# Altium project Core.PrjPcb
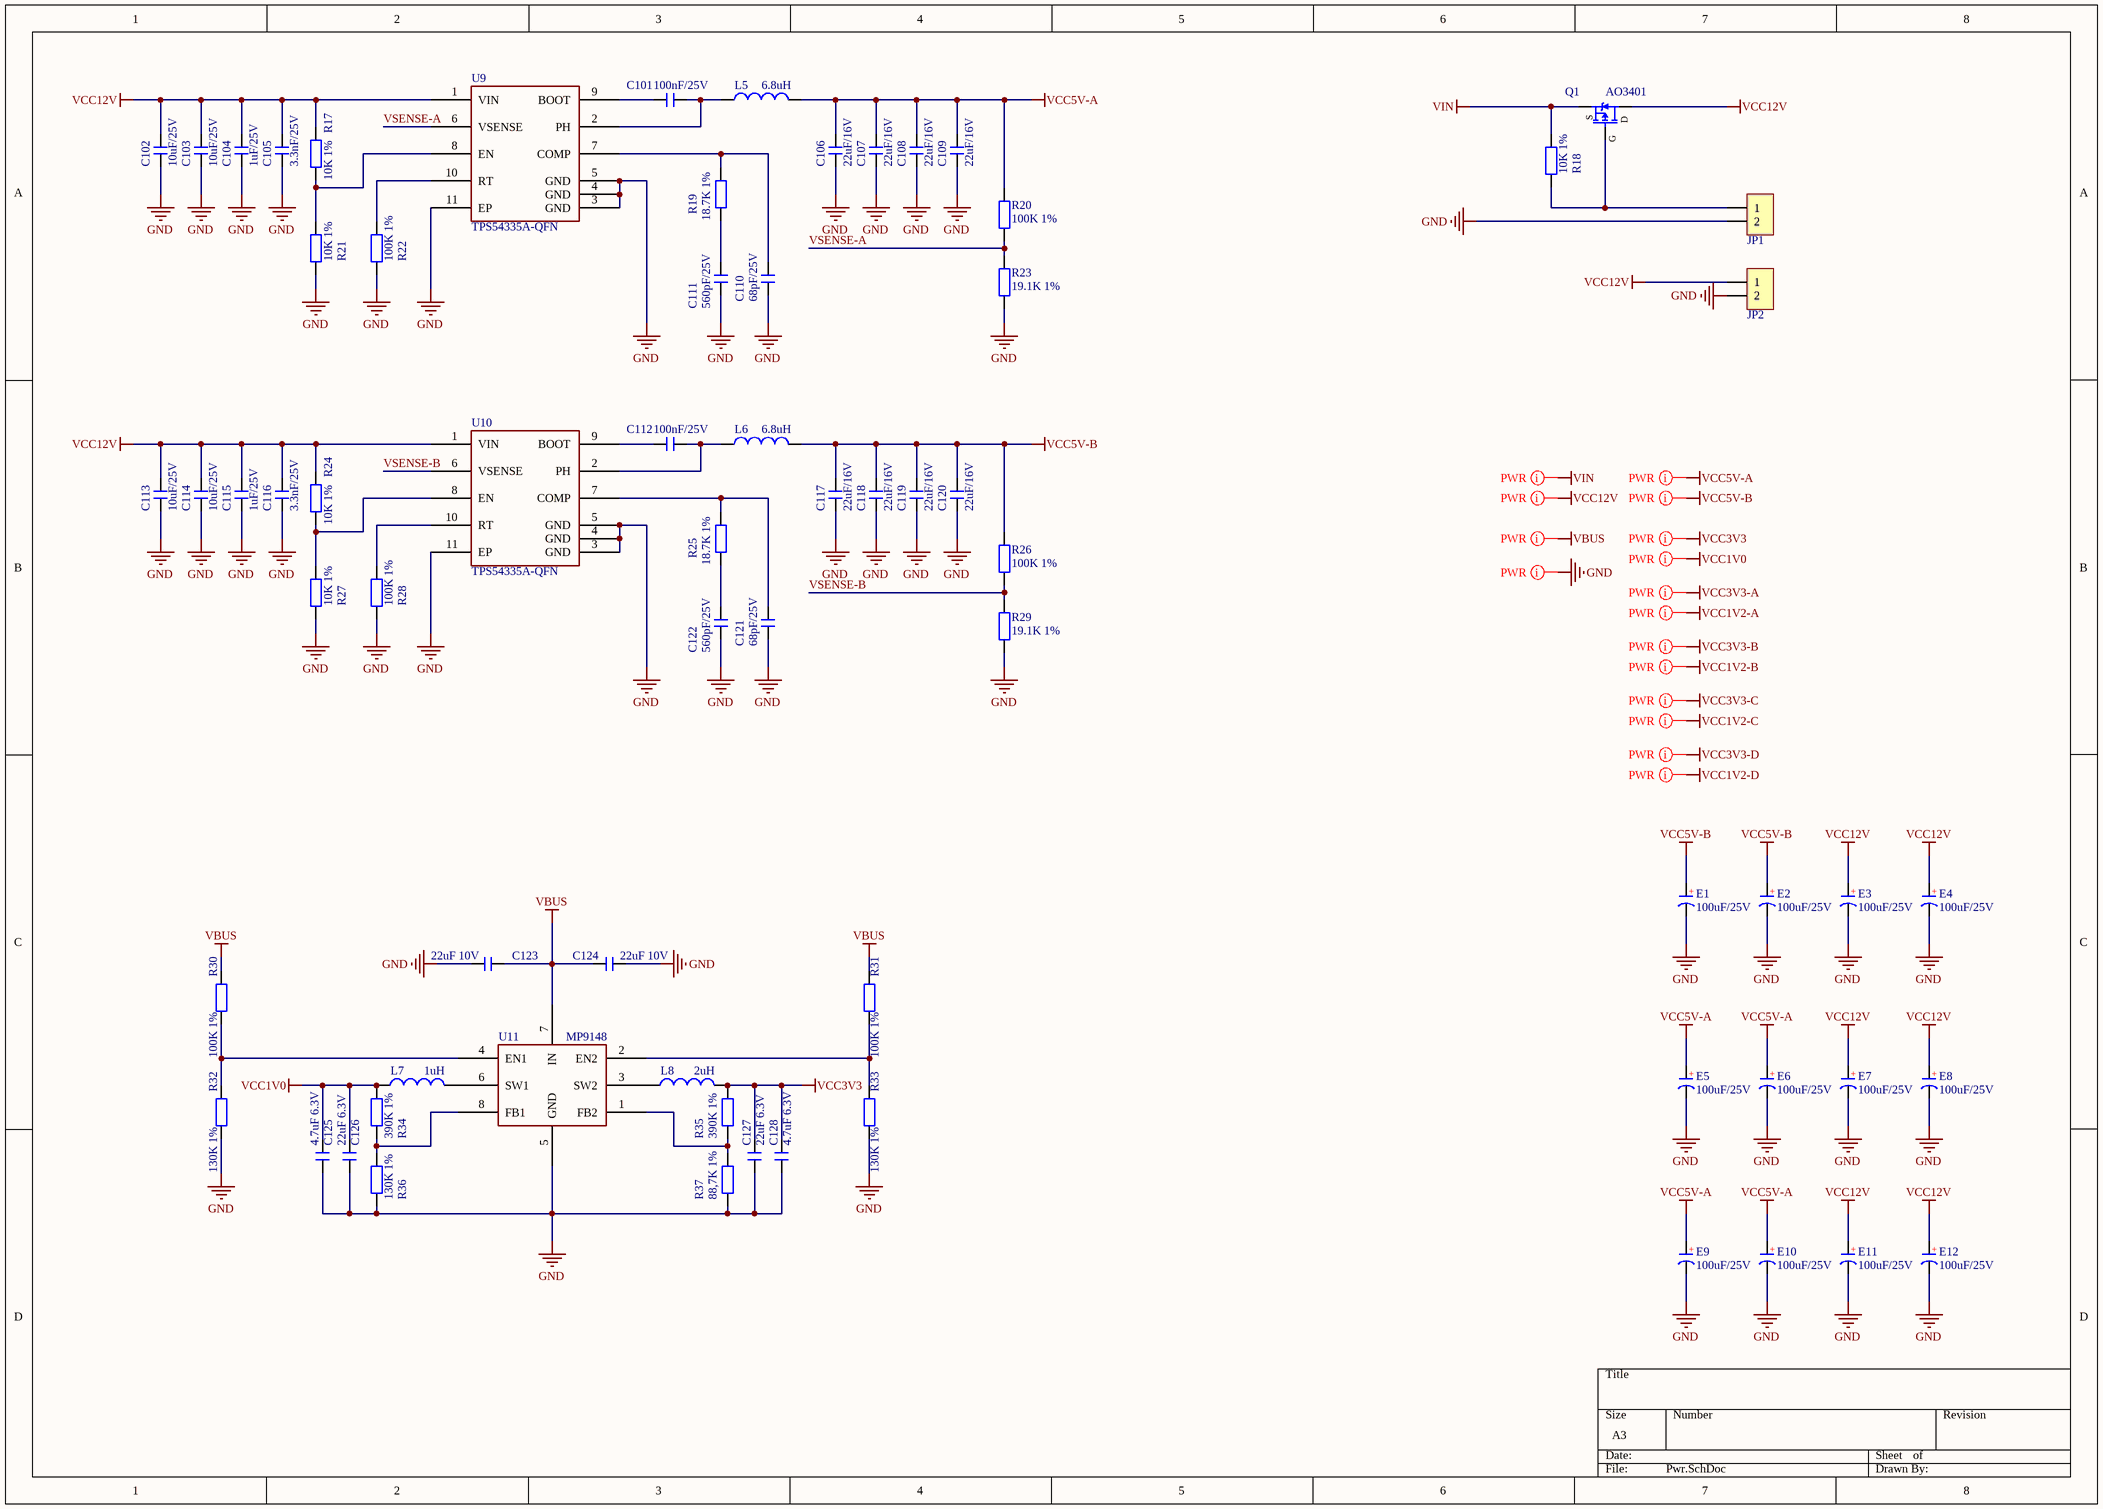
[diagram p0: Pwr.SchDoc]
2 sheets, 125 parts. Net scope: global (net labels, ports and power ports of the same name join across sheets).
Board files: PCB1.PcbDoc, Core.PcbDoc
Sheets:
  Pwr.SchDoc
  Vl822.SchDoc

## Sheet Pwr.SchDoc
size A3; SheetNumber: 3; SheetTotal: 4

### Parts
C101  100nF/25V  [C0402_L]
C102  10uF/25V  [C0603_L]
C103  10uF/25V  [C0603_L]
C104  1uF/25V  [C0603_L]
C105  3.3nF/25V  [C0603_L]
C106  22uF/16V  [C0603_L]
C107  22uF/16V  [C0603_L]
C108  22uF/16V  [C0603_L]
C109  22uF/16V  [C0603_L]
C110  68pF/25V  [C0402_L]
C111  560pF/25V  [C0402_L]
C112  100nF/25V  [C0402_L]
C113  10uF/25V  [C0603_L]
C114  10uF/25V  [C0603_L]
C115  1uF/25V  [C0603_L]
C116  3.3nF/25V  [C0603_L]
C117  22uF/16V  [C0603_L]
C118  22uF/16V  [C0603_L]
C119  22uF/16V  [C0603_L]
C120  22uF/16V  [C0603_L]
C121  68pF/25V  [C0402_L]
C122  560pF/25V  [C0402_L]
C123  22uF 10V  [C0603_L]
C124  22uF 10V  [C0603_L]
C125  4.7uF 6.3V  [C0603_L]
C126  22uF 6.3V  [C0603_L]
C127  22uF 6.3V  [C0603_L]
C128  4.7uF 6.3V  [C0603_L]
E1  100uF/25V  [CS 6*4 - B]
E2  100uF/25V  [CS 6*4 - B]
E3  100uF/25V  [CS 6*4 - B]
E4  100uF/25V  [CS 6*4 - B]
E5  100uF/25V  [CS 6*4 - B]
E6  100uF/25V  [CS 6*4 - B]
E7  100uF/25V  [CS 6*4 - B]
E8  100uF/25V  [CS 6*4 - B]
E9  100uF/25V  [CS 6*4 - B]
E10  100uF/25V  [CS 6*4 - B]
E11  100uF/25V  [CS 6*4 - B]
E12  100uF/25V  [CS 6*4 - B]
JP1  HDR-1X2  [ZH1.5-WS-2P]  (value not drawn)
JP2  HDR-1X2  [XH2.54-WS-2P]  (value not drawn)
L5  6.8uH  [NR4020]
L6  6.8uH  [NR4020]
L7  1uH  [NR4020]
L8  2uH  [NR4020]
Q1  AO3401  [DFN8-L3.0-W3.0-P0.65_EP]
R17  10K 1%  [R0402_L]
R18  10K 1%  [R0402_L]
R19  18.7K 1%  [R0402_L]
R20  100K 1%  [R0402_L]
R21  10K 1%  [R0402_L]
R22  100K 1%  [R0402_L]
R23  19.1K 1%  [R0402_L]
R24  10K 1%  [R0402_L]
R25  18.7K 1%  [R0402_L]
R26  100K 1%  [R0402_L]
R27  10K 1%  [R0402_L]
R28  100K 1%  [R0402_L]
R29  19.1K 1%  [R0402_L]
R30  100K 1%  [R0402_L]
R31  100K 1%  [R0402_L]
R32  130K 1%  [R0402_L]
R33  130K 1%  [R0402_L]
R34  390K 1%  [R0402_L]
R35  390K 1%  [R0402_L]
R36  130K 1%  [R0402_L]
R37  88,7K 1%  [R0402_L]
U9  TPS54335A-QFN  [VSON-10_L3.0-W3.0-P0.50-TL-EP]
U10  TPS54335A-QFN  [VSON-10_L3.0-W3.0-P0.50-TL-EP]
U11  MP9148  [SOT23-8]

### Nets
GND: C102.1 C103.1 C104.1 C105.1 C106.1 C107.1 C108.1 C109.1 C110.1 C111.1 C113.1 C114.1 C115.1 C116.1 C117.1 C118.1 C119.1 C120.1 C121.1 C122.1 C123.1 C124.1 C125.1 C126.1 C127.1 C128.1 E1.2(K) E2.2(K) E3.2(K) E4.2(K) E5.2(K) E6.2(K) E7.2(K) E8.2(K) E9.2(K) E10.2(K) E11.2(K) E12.2(K) JP1.2 JP2.2 R21.2 R22.2 R23.2 R27.2 R28.2 R29.2 R32.2 R33.2 R36.2 R37.2 U9.3(GND) U9.4(GND) U9.5(GND) U9.11(EP) U10.3(GND) U10.4(GND) U10.5(GND) U10.11(EP) U11.5(GND)
VBUS: C123.2 C124.2 R30.1 R31.1 U11.7(IN)
VCC1V0: C125.2 C126.2 L7.1 R34.1
VCC3V3: C127.2 C128.2 L8.1 R35.1
VCC5V-A: C106.2 C107.2 C108.2 C109.2 E5.1(A) E6.1(A) E9.1(A) E10.1(A) L5.2 R20.1
VCC5V-B: C117.2 C118.2 C119.2 C120.2 E1.1(A) E2.1(A) L6.2 R26.1
VCC12V: C102.2 C103.2 C104.2 C105.2 C113.2 C114.2 C115.2 C116.2 E3.1(A) E4.1(A) E7.1(A) E8.1(A) E11.1(A) E12.1(A) JP2.1 Q1.3(D) R17.1 R24.1 U9.1(VIN) U10.1(VIN)
VIN: Q1.2(S) R18.1
VSENSE-A: R20.2 R23.1 U9.6(VSENSE)
VSENSE-B: R26.2 R29.1 U10.6(VSENSE)
NetC101_1: C101.1 L5.1 U9.2(PH)
NetC101_2: C101.2 U9.9(BOOT)
NetC110_2: C110.2 R19.1 U9.7(COMP)
NetC111_2: C111.2 R19.2
NetC112_1: C112.1 L6.1 U10.2(PH)
NetC112_2: C112.2 U10.9(BOOT)
NetC121_2: C121.2 R25.1 U10.7(COMP)
NetC122_2: C122.2 R25.2
NetJP1_1: JP1.1 Q1.1(G) R18.2
NetL7_2: L7.2 U11.6(SW1)
NetL8_2: L8.2 U11.3(SW2)
NetR17_2: R17.2 R21.1 U9.8(EN)
NetR22_1: R22.1 U9.10(RT)
NetR24_2: R24.2 R27.1 U10.8(EN)
NetR28_1: R28.1 U10.10(RT)
NetR30_2: R30.2 R32.1 U11.4(EN1)
NetR31_2: R31.2 R33.1 U11.2(EN2)
NetR34_2: R34.2 R36.1 U11.8(FB1)
NetR35_2: R35.2 R37.1 U11.1(FB2)

### Layout directives
net class PWR; rule Width Constraint [Pref Width = 8mil    Min Width = 6mil    Max Width = 50mil]: GND, VBUS, VCC1V0, VCC1V2-A, VCC1V2-B, VCC1V2-C, VCC1V2-D, VCC3V3, VCC3V3-A, VCC3V3-B, VCC3V3-D, VCC5V-A, VCC5V-B, VCC12V, VIN
net class PWR: VCC3V3-C

### Notes on the sheet
- Labels drawn without touching a wire or pin: GND, VBUS, VCC1V0, VCC1V2-A, VCC1V2-B, VCC1V2-C, VCC1V2-D, VCC3V3, VCC3V3-A, VCC3V3-B, VCC3V3-C, VCC3V3-D, VCC5V-A, VCC5V-B, VCC12V, VIN
- (in symbol C-CD) +

### Library data of the parts
C101-C128 = C: 无极性贴片电容; 版权归属: 源创客; 材质: X7R; BOM名称: 无极性贴片电容; 学习资源: www.ooocke.com
E1-E12 = C-CD: 贴片钽电容; 版权归属: 源创客; BOM名称: 贴片钽电容; 学习资源: www.ooocke.com
JP1 JP2 = Header 2: 2P接插件; 版权归属: 源创客; BOM名称: 2P接插件; 学习资源: www.ooocke.com
L5-L8 = L: 小功率贴片电感; 版权归属: 源创客; BOM名称: 小功率贴片电感; 学习资源: www.ooocke.com
Q1 = AO3401: P沟道 30V/4.2A; BOM名称: 场效应管; 版权归属: 源创客; 学习资源: www.ooocke.com; 描述: P沟道 30V/4.2A
R17-R37 = R: 贴片电阻; 版权归属: 源创客; BOM名称: 贴片电阻; 学习资源: www.ooocke.com
U9 U10 = TPS54335A-QFN: BUCK
U11 = MP9148: BUCK

## Sheet Vl822.SchDoc
size A3; SheetNumber: 4; SheetTotal: 4
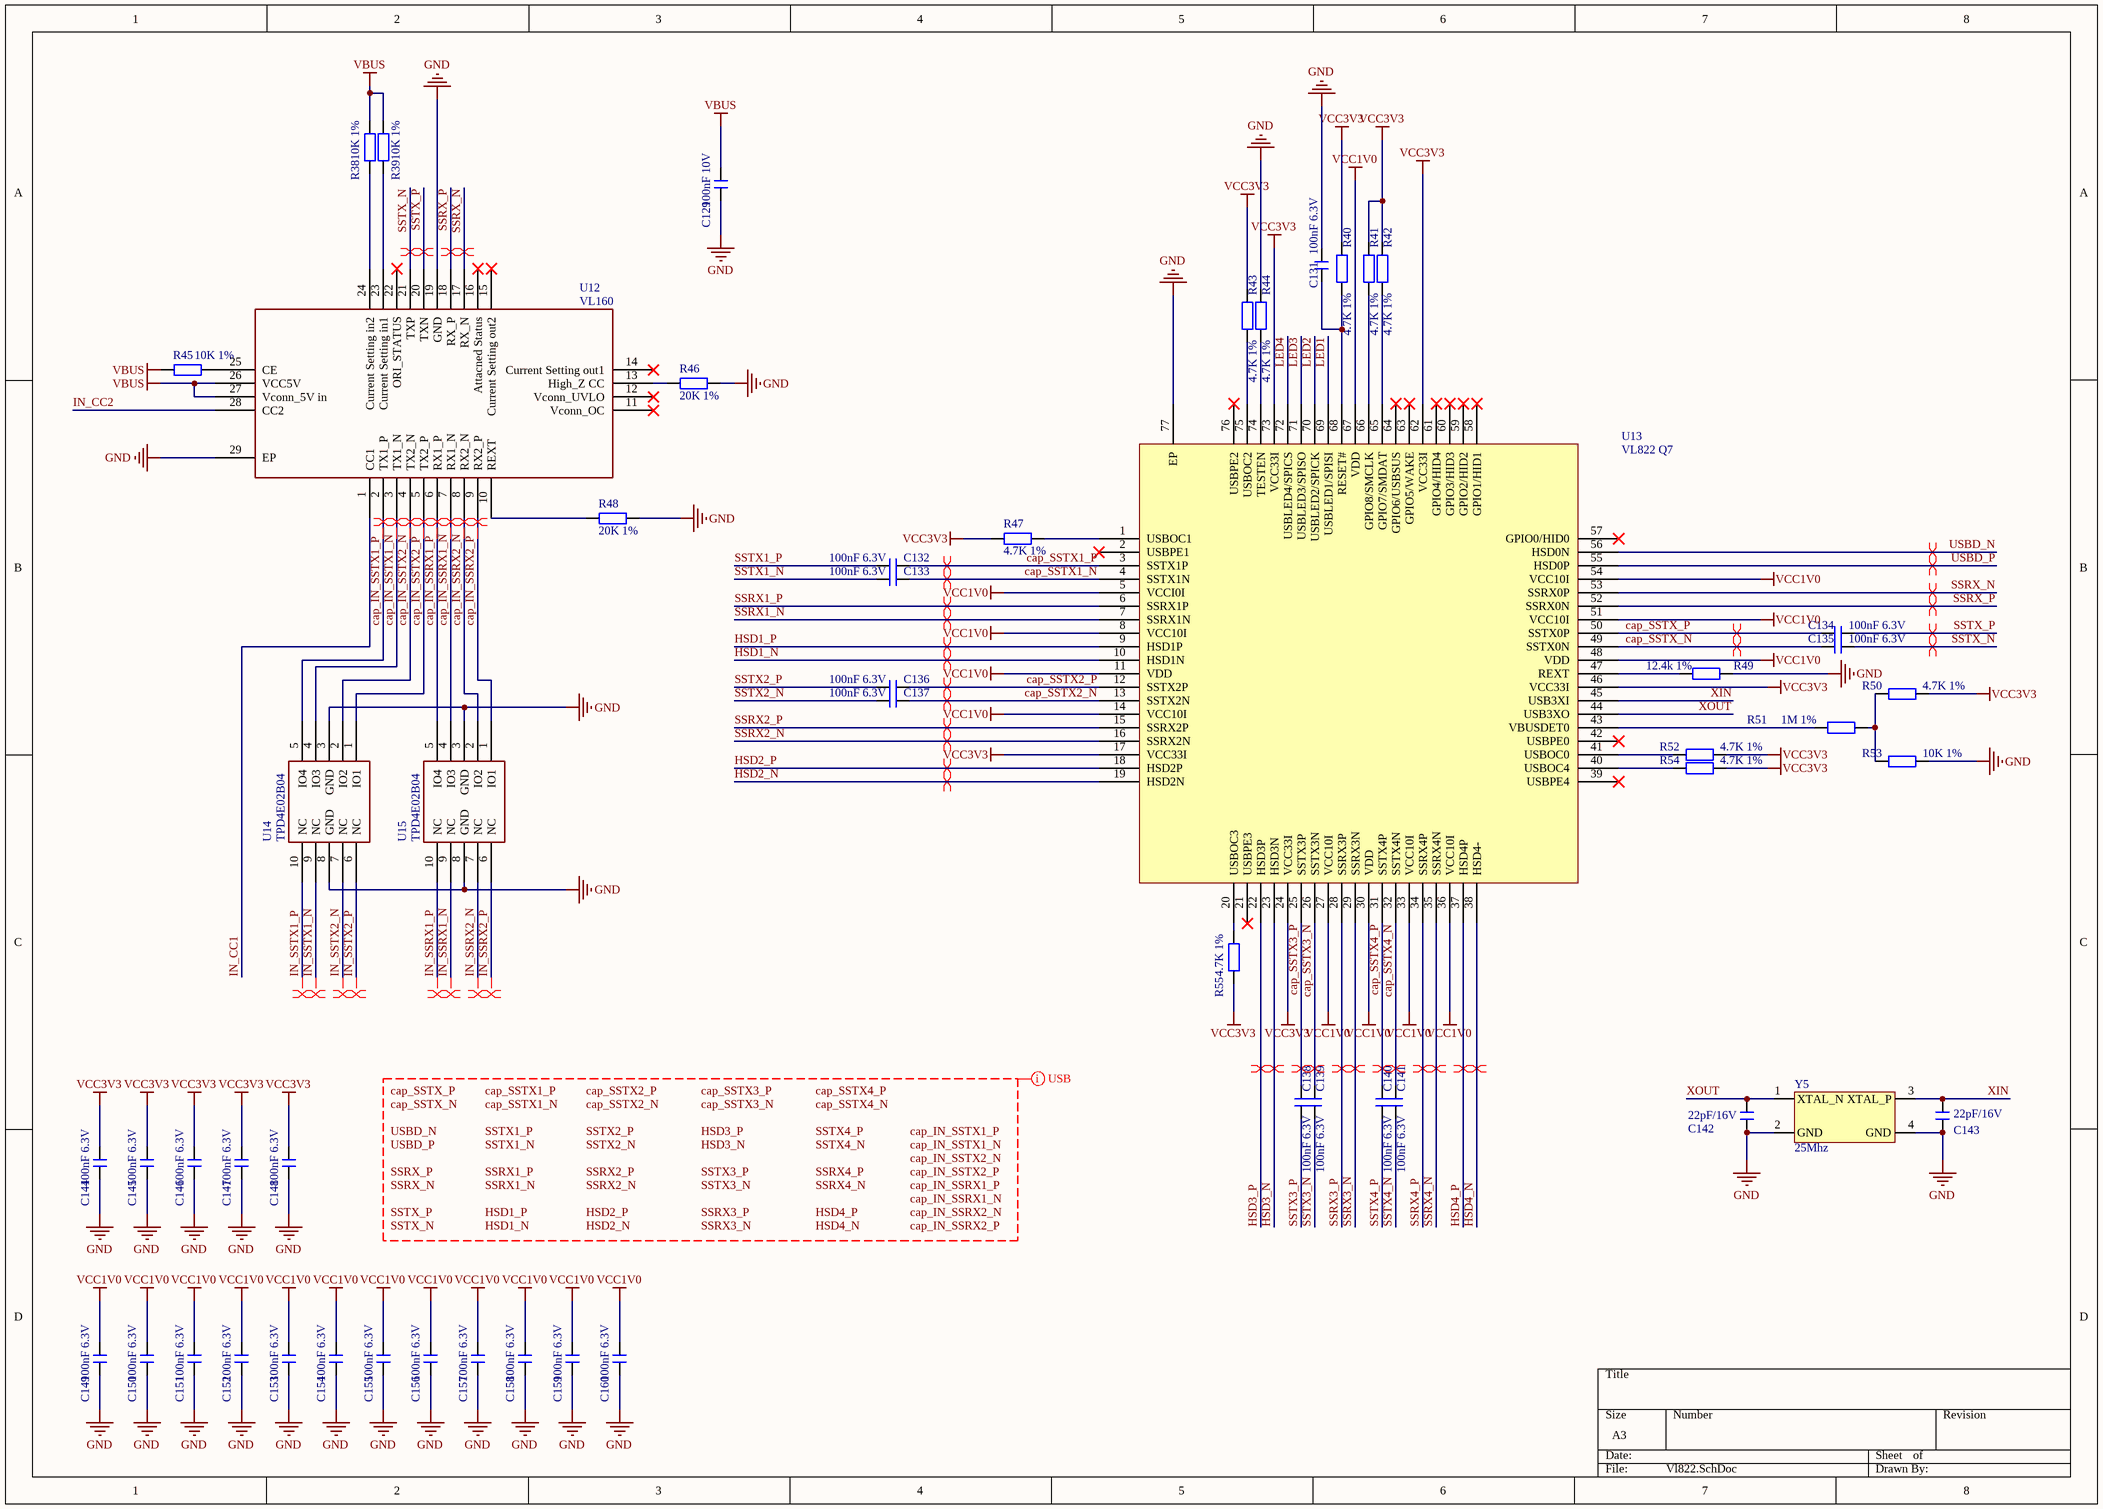
[diagram p1: Vl822.SchDoc]

### Parts
C129  100nF 10V  [C0402_L]
C131  100nF 6.3V  [C0402_L]
C132  100nF 6.3V  [C0402_L]
C133  100nF 6.3V  [C0402_L]
C134  100nF 6.3V  [C0402_L]
C135  100nF 6.3V  [C0402_L]
C136  100nF 6.3V  [C0402_L]
C137  100nF 6.3V  [C0402_L]
C138  100nF 6.3V  [C0402_L]
C139  100nF 6.3V  [C0402_L]
C140  100nF 6.3V  [C0402_L]
C141  100nF 6.3V  [C0402_L]
C142  22pF/16V  [C0402_L]
C143  22pF/16V  [C0402_L]
C144  100nF 6.3V  [C0402_L]
C145  100nF 6.3V  [C0402_L]
C146  100nF 6.3V  [C0402_L]
C147  100nF 6.3V  [C0402_L]
C148  100nF 6.3V  [C0402_L]
C149  100nF 6.3V  [C0402_L]
C150  100nF 6.3V  [C0402_L]
C151  100nF 6.3V  [C0402_L]
C152  100nF 6.3V  [C0402_L]
C153  100nF 6.3V  [C0402_L]
C154  100nF 6.3V  [C0402_L]
C155  100nF 6.3V  [C0402_L]
C156  100nF 6.3V  [C0402_L]
C157  100nF 6.3V  [C0402_L]
C158  100nF 6.3V  [C0402_L]
C159  100nF 6.3V  [C0402_L]
C160  100nF 6.3V  [C0402_L]
R38  10K 1%  [R0402_L]
R39  10K 1%  [R0402_L]
R40  4.7K 1%  [R0402_L]
R41  4.7K 1%  [R0402_L]
R42  4.7K 1%  [R0402_L]
R43  4.7K 1%  [R0402_L]
R44  4.7K 1%  [R0402_L]
R45  10K 1%  [R0402_L]
R46  20K 1%  [R0402_L]
R47  4.7K 1%  [R0402_L]
R48  20K 1%  [R0402_L]
R49  12.4k 1%  [R0402_L]
R50  4.7K 1%  [R0402_L]
R51  1M 1%  [R0402_L]
R52  4.7K 1%  [R0402_L]
R53  10K 1%  [R0402_L]
R54  4.7K 1%  [R0402_L]
R55  4.7K 1%  [R0402_L]
U12  VL160  [MQFN-28_L4.5-W3.5-P0.40-BL-EP]
U13  VL822 Q7  [QFN-76_L9.0-W9.0-P0.40-EP6.3-TL]
U14  TPD4E02B04  [DIO_TPD4E02B04DQAR]
U15  TPD4E02B04  [DIO_TPD4E02B04DQAR]
Y5  25Mhz  [OSC 3225-4P]

### Nets
GND: C129.1 C131.2 C142.2 C143.2 C144.1 C145.1 C146.1 C147.1 C148.1 C149.1 C150.1 C151.1 C152.1 C153.1 C154.1 C155.1 C156.1 C157.1 C158.1 C159.1 C160.1 R44.2 R46.1 R48.1 R49.2 R53.2 U12.19(GND) U12.29(EP) U13.77(EP) U14.3(GND) U14.8(GND) U15.3(GND) U15.8(GND) Y5.2(GND) Y5.4(GND)
VBUS: C129.2 R38.1 R39.1 R45.2 U12.26(VCC5V) U12.27(Vconn_5V_in)
VCC1V0: C149.2 C150.2 C151.2 C152.2 C153.2 C154.2 C155.2 C156.2 C157.2 C158.2 C159.2 C160.2 U13.5(VCCI0I) U13.8(VCC10I) U13.11(VDD) U13.14(VCC10I) U13.27(VCC10I) U13.30(VDD) U13.33(VCC10I) U13.36(VCC10I) U13.48(VDD) U13.51(VCC10I) U13.54(VCC10I) U13.67(VDD)
VCC3V3: C144.2 C145.2 C146.2 C147.2 C148.2 R40.2 R41.2 R42.2 R43.2 R47.2 R50.2 R52.2 R54.2 R55.2 U13.17(VCC33I) U13.24(VCC33I) U13.46(VCC33I) U13.62(VCC33I) U13.73(VCC33I)
cap_IN_SSRX1_N: U12.7(RX1_N) U15.4(IO3)
cap_IN_SSRX1_P: U12.6(RX1_P) U15.5(IO4)
cap_IN_SSRX2_N: U12.8(RX2_N) U15.2(IO2)
cap_IN_SSRX2_P: U12.9(RX2_P) U15.1(IO1)
cap_IN_SSTX1_N: U12.3(TX1_N) U14.4(IO3)
cap_IN_SSTX1_P: U12.2(TX1_P) U14.5(IO4)
cap_IN_SSTX2_N: U12.4(TX2_N) U14.2(IO2)
cap_IN_SSTX2_P: U12.5(TX2_P) U14.1(IO1)
cap_SSTX1_N: C133.2 U13.4(SSTX1N)
cap_SSTX1_P: C132.2 U13.3(SSTX1P)
cap_SSTX2_N: C137.2 U13.13(SSTX2N)
cap_SSTX2_P: C136.2 U13.12(SSTX2P)
cap_SSTX3_N: C139.2 U13.26(SSTX3N)
cap_SSTX3_P: C138.2 U13.25(SSTX3P)
cap_SSTX4_N: C141.2 U13.32(SSTX4N)
cap_SSTX4_P: C140.2 U13.31(SSTX4P)
cap_SSTX_N: C135.2 U13.49(SSTX0N)
cap_SSTX_P: C134.2 U13.50(SSTX0P)
HSD1_N: U13.10(HSD1N)
HSD1_P: U13.9(HSD1P)
HSD2_N: U13.19(HSD2N)
HSD2_P: U13.18(HSD2P)
HSD3_N: U13.23(HSD3N)
HSD3_P: U13.22(HSD3P)
HSD4_N: U13.38(HSD4-)
HSD4_P: U13.37(HSD4P)
IN_CC1: U12.1(CC1)
IN_CC2: U12.28(CC2)
IN_SSRX1_N: U15.9(NC)
IN_SSRX1_P: U15.10(NC)
IN_SSRX2_N: U15.7(NC)
IN_SSRX2_P: U15.6(NC)
IN_SSTX1_N: U14.9(NC)
IN_SSTX1_P: U14.10(NC)
IN_SSTX2_N: U14.7(NC)
IN_SSTX2_P: U14.6(NC)
LED1: U13.69(USBLED1/SPISI)
LED2: U13.70(USBLED2/SPICK)
LED3: U13.71(USBLED3/SPISO)
LED4: U13.72(USBLED4/SPICS)
SSRX1_N: U13.7(SSRX1N)
SSRX1_P: U13.6(SSRX1P)
SSRX2_N: U13.16(SSRX2N)
SSRX2_P: U13.15(SSRX2P)
SSRX3_N: U13.29(SSRX3N)
SSRX3_P: U13.28(SSRX3P)
SSRX4_N: U13.35(SSRX4N)
SSRX4_P: U13.34(SSRX4P)
SSRX_N: U12.17(RX_N) U13.53(SSRX0P)
SSRX_P: U12.18(RX_P) U13.52(SSRX0N)
SSTX1_N: C133.1
SSTX1_P: C132.1
SSTX2_N: C137.1
SSTX2_P: C136.1
SSTX3_N: C139.1
SSTX3_P: C138.1
SSTX4_N: C141.1
SSTX4_P: C140.1
SSTX_N: C135.1 U12.21(TXP)
SSTX_P: C134.1 U12.20(TXN)
USBD_N: U13.56(HSD0N)
USBD_P: U13.55(HSD0P)
XIN: C143.1 U13.45(USB3XI) Y5.3(XTAL_P)
XOUT: C142.1 U13.44(USB3XO) Y5.1(XTAL_N)
NetC131_1: C131.1 R40.1 U13.68(RESET#)
NetR38_2: R38.2 U12.24(Current_Setting_in2)
NetR39_2: R39.2 U12.23(Current_Setting_in1)
NetR41_1: R41.1 U13.66(GPIO8/SMCLK)
NetR42_1: R42.1 U13.65(GPIO7/SMDAT)
NetR43_1: R43.1 U13.75(USBOC2)
NetR44_1: R44.1 U13.74(TESTEN)
NetR45_1: R45.1 U12.25(CE)
NetR46_2: R46.2 U12.13(High_Z_CC)
NetR47_1: R47.1 U13.1(USBOC1)
NetR48_2: R48.2 U12.10(REXT)
NetR49_1: R49.1 U13.47(REXT)
NetR50_1: R50.1 R51.2 R53.1
NetR51_1: R51.1 U13.43(VBUSDET0)
NetR52_1: R52.1 U13.41(USBOC0)
NetR54_1: R54.1 U13.40(USBOC4)
NetR55_1: R55.1 U13.20(USBOC3)

Not connected (* = marked no-connect by the designer): U12 11(Vconn_OC)* 12(Vconn_UVLO)* 14(Current_Setting_out1)* 15(Current_Setting_out2)* 16(Attacned_Status)* 22(ORI_STATUS)*; U13 2(USBPE1)* 21(USBPE3)* 39(USBPE4)* 42(USBPE0)* 57(GPIO0/HID0)* 58(GPIO1/HID1)* 59(GPIO2/HID2)* 60(GPIO3/HID3)* 61(GPIO4/HID4)* 63(GPIO5/WAKE)* 64(GPIO6/USBSUS)* 76(USBPE2)*

### Layout directives
differential pair: cap_IN_SSRX1_N, cap_IN_SSRX1_P, cap_IN_SSRX2_N, cap_IN_SSRX2_P, cap_IN_SSTX1_N, cap_IN_SSTX1_P, cap_IN_SSTX2_N, cap_IN_SSTX2_P, cap_SSTX1_N, cap_SSTX1_P, cap_SSTX2_N, cap_SSTX2_P, cap_SSTX3_N, cap_SSTX3_P, cap_SSTX4_N, cap_SSTX4_P, cap_SSTX_N, cap_SSTX_P, HSD1_N, HSD1_P, HSD2_N, HSD2_P, HSD3_N, HSD3_P, HSD4_N, HSD4_P, IN_SSRX1_N, IN_SSRX1_P, IN_SSRX2_N, IN_SSRX2_P, IN_SSTX1_N, IN_SSTX1_P, IN_SSTX2_N, IN_SSTX2_P, SSRX1_N, SSRX1_P, SSRX2_N, SSRX2_P, SSRX3_N, SSRX3_P, SSRX4_N, SSRX4_P, SSRX_N, SSRX_P, SSTX_N, SSTX_P, USBD_N, USBD_P
net class USB; rule Differential Pairs Routing [Pref Gap = 4mil    Min Gap  = 4mil    Max Gap  = 4milPref Width = 5.15mil    Min Width  = 5.15mil    Max Width  = 5.15mil]: cap_IN_SSRX1_N, cap_IN_SSRX1_P, cap_IN_SSRX2_N, cap_IN_SSRX2_P, cap_IN_SSTX1_N, cap_IN_SSTX1_P, cap_IN_SSTX2_N, cap_IN_SSTX2_P, cap_SSTX1_N, cap_SSTX1_P, cap_SSTX2_N, cap_SSTX2_P, cap_SSTX3_N, cap_SSTX3_P, cap_SSTX4_N, cap_SSTX4_P, cap_SSTX_N, cap_SSTX_P, HSD1_N, HSD1_P, HSD2_N, HSD2_P, HSD3_N, HSD3_P, HSD4_N, HSD4_P, SSRX1_N, SSRX1_P, SSRX2_N, SSRX2_P, SSRX3_N, SSRX3_P, SSRX4_N, SSRX4_P, SSRX_N, SSRX_P, SSTX1_N, SSTX1_P, SSTX2_N, SSTX2_P, SSTX3_N, SSTX3_P, SSTX4_N, SSTX4_P, SSTX_N, SSTX_P, USBD_N, USBD_P

### Notes on the sheet
- Labels drawn without touching a wire or pin: cap_IN_SSRX1_N, cap_IN_SSRX1_P, cap_IN_SSRX2_N, cap_IN_SSRX2_P, cap_IN_SSTX1_N, cap_IN_SSTX1_P, cap_IN_SSTX2_N, cap_IN_SSTX2_P, cap_SSTX1_N, cap_SSTX1_P, cap_SSTX2_N, cap_SSTX2_P, cap_SSTX3_N, cap_SSTX3_P, cap_SSTX4_N, cap_SSTX4_P, cap_SSTX_N, cap_SSTX_P, HSD1_N, HSD1_P, HSD2_N, HSD2_P, HSD3_N, HSD3_P, HSD4_N, HSD4_P, SSRX1_N, SSRX1_P, SSRX2_N, SSRX2_P, SSRX3_N, SSRX3_P, SSRX4_N, SSRX4_P, SSRX_N, SSRX_P, SSTX1_N, SSTX1_P, SSTX2_N, SSTX2_P, SSTX3_N, SSTX3_P, SSTX4_N, SSTX4_P, SSTX_N, SSTX_P, USBD_N, USBD_P

### Library data of the parts
C129 C131-C160 = C: 无极性贴片电容; 版权归属: 源创客; 材质: X7R; BOM名称: 无极性贴片电容; 学习资源: www.ooocke.com
R38-R55 = R: 贴片电阻; 版权归属: 源创客; BOM名称: 贴片电阻; 学习资源: www.ooocke.com
U14 U15 = TPD4E02B04: ESD
Y5 = Crystal

## Nets that join several sheets
GND: Pwr (59 pins), Vl822 (35 pins)
VBUS: Pwr (5 pins), Vl822 (6 pins)
VCC1V0: Pwr (C125.2 C126.2 L7.1 R34.1), Vl822 (24 pins)
VCC3V3: Pwr (C127.2 C128.2 L8.1 R35.1), Vl822 (19 pins)